# Altium schematic sheet 03_MCU部分.SchDoc
size A4; DocumentNumber: 3; SheetNumber: 3; SheetTotal: 4
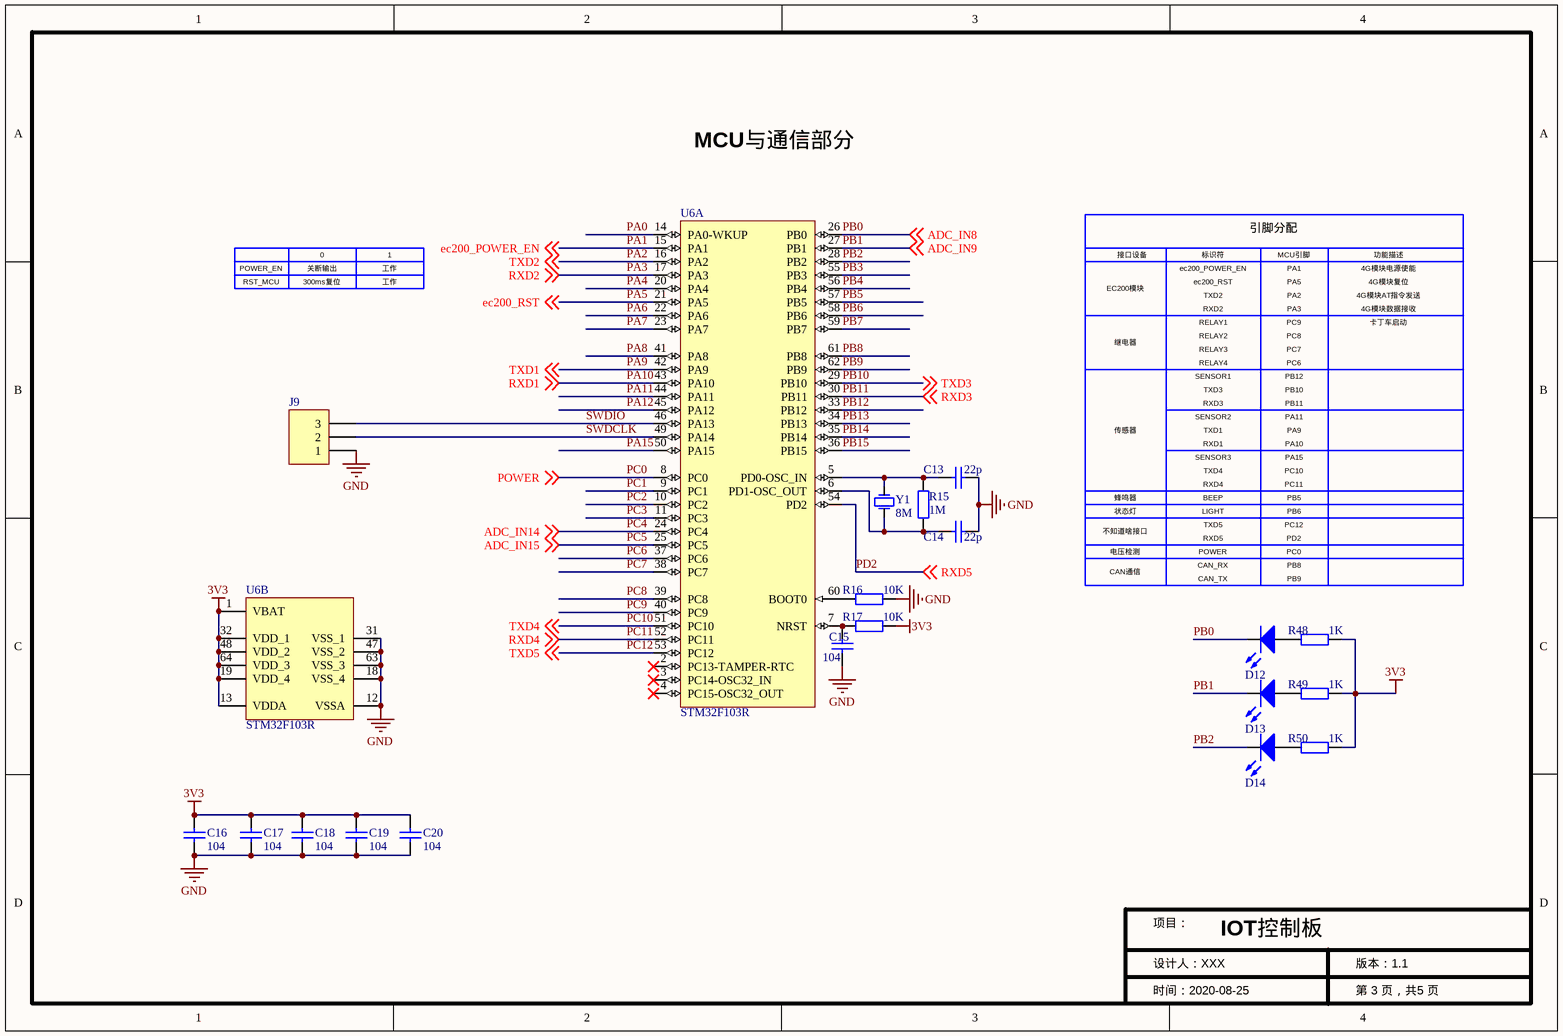
[diagram p0: 03_MCU部分.SchDoc]

## Parts
C13  value 22p  [CAP-0603]  (hidden comment: Cap)
C14  value 22p  [CAP-0603]  (hidden comment: Cap)
C15  value 104  [CAP-0603]  (hidden comment: Cap)
C16  value 104  [CAP-0603]  (hidden comment: Cap)
C17  value 104  [CAP-0603]  (hidden comment: Cap)
C18  value 104  [CAP-0603]  (hidden comment: Cap)
C19  value 104  [CAP-0603]  (hidden comment: Cap)
C20  value 104  [CAP-0603]  (hidden comment: Cap)
D12  LED  [LED_0805]  (value not drawn)
D13  LED  [LED_0805]  (value not drawn)
D14  LED  [LED_0805]  (value not drawn)
J9  Header3  [Header_3X1_2.54_排针]  (value not drawn)
R15  value 1M  [0603]  (hidden comment: Res)
R16  value 10K  [0603]  (hidden comment: Res)
R17  value 10K  [0603]  (hidden comment: Res)
R48  value 1K  [0603]  (hidden comment: Res)
R49  value 1K  [0603]  (hidden comment: Res)
R50  value 1K  [0603]  (hidden comment: Res)
U6  STM32F103R  [LQFP64]  (parts A,B of 2)
Y1  value 8M  [X-SM49]  (hidden comment: XTAL)

## Nets
3V3: C16.2 C17.2 C18.2 C19.2 C20.2 R17.1 R48.1 R49.1 R50.1 U6.1(VBAT) U6.13(VDDA) U6.19(VDD_4) U6.32(VDD_1) U6.48(VDD_2) U6.64(VDD_3)
GND: C13.1 C14.1 C15.1 C16.1 C17.1 C18.1 C19.1 C20.1 J9.1 R16.1 U6.12(VSSA) U6.18(VSS_4) U6.31(VSS_1) U6.47(VSS_2) U6.63(VSS_3)
PA0: U6.14(PA0-WKUP)
PA1: U6.15(PA1) ; off-sheet ec200_POWER_EN  [also labelled ec200_POWER_EN]
PA2: U6.16(PA2) ; off-sheet TXD2  [also labelled TXD2]
PA3: U6.17(PA3) ; off-sheet RXD2  [also labelled RXD2]
PA4: U6.20(PA4)
PA5: U6.21(PA5) ; off-sheet ec200_RST  [also labelled ec200_RST]
PA6: U6.22(PA6)
PA7: U6.23(PA7)
PA8: U6.41(PA8)
PA9: U6.42(PA9) ; off-sheet TXD1  [also labelled TXD1]
PA10: U6.43(PA10) ; off-sheet RXD1  [also labelled RXD1]
PA11: U6.44(PA11)
PA12: U6.45(PA12)
PA15: U6.50(PA15)
PB0: D12.2(K) U6.26(PB0) ; off-sheet ADC_IN8  [also labelled ADC_IN8]
PB1: D13.2(K) U6.27(PB1) ; off-sheet ADC_IN9  [also labelled ADC_IN9]
PB2: D14.2(K) U6.28(PB2)
PB3: U6.55(PB3)
PB4: U6.56(PB4)
PB5: U6.57(PB5)
PB6: U6.58(PB6)
PB7: U6.59(PB7)
PB8: U6.61(PB8)
PB9: U6.62(PB9)
PB10: U6.29(PB10) ; off-sheet TXD3  [also labelled TXD3]
PB11: U6.30(PB11) ; off-sheet RXD3  [also labelled RXD3]
PB12: U6.33(PB12)
PB13: U6.34(PB13)
PB14: U6.35(PB14)
PB15: U6.36(PB15)
PC0: U6.8(PC0) ; off-sheet POWER  [also labelled POWER]
PC1: U6.9(PC1)
PC2: U6.10(PC2)
PC3: U6.11(PC3)
PC4: U6.24(PC4) ; off-sheet ADC_IN14  [also labelled ADC_IN14]
PC5: U6.25(PC5) ; off-sheet ADC_IN15  [also labelled ADC_IN15]
PC6: U6.37(PC6)
PC7: U6.38(PC7)
PC8: U6.39(PC8)
PC9: U6.40(PC9)
PC10: U6.51(PC10) ; off-sheet TXD4  [also labelled TXD4]
PC11: U6.52(PC11) ; off-sheet RXD4  [also labelled RXD4]
PC12: U6.53(PC12) ; off-sheet TXD5  [also labelled TXD5]
PD2: U6.54(PD2) ; off-sheet RXD5  [also labelled RXD5]
SWDCLK: J9.2 U6.49(PA14)
SWDIO: J9.3 U6.46(PA13)
NetC13_2: C13.2 R15.2 U6.5(PD0-OSC_IN) Y1.2
NetC14_2: C14.2 R15.1 U6.6(PD1-OSC_OUT) Y1.1
NetC15_2: C15.2 R17.2 U6.7(NRST)
NetD12_1: D12.1(A) R48.2
NetD13_1: D13.1(A) R49.2
NetD14_1: D14.1(A) R50.2
NetR16_2: R16.2 U6.60(BOOT0)

Not connected (* = marked no-connect by the designer): U6 2(PC13-TAMPER-RTC)* 3(PC14-OSC32_IN)* 4(PC15-OSC32_OUT)*

## Notes on the sheet
- MCU与通信部分
- 0
- 1
- 接口设备
- 标识符
- 引脚分配
- MCU引脚
- 功能描述
- POWER_EN
- RST_MCU
- 关断输出
- 300ms复位
- 工作
- EC200模块
- ec200_POWER_EN
- ec200_RST
- TXD2
- RXD2
- PA1
- PA5
- PA2
- PA3
- 4G模块电源使能
- 4G模块复位
- 4G模块AT指令发送
- 4G模块数据接收
- 继电器
- RELAY1
- RELAY2
- RELAY3
- RELAY4
- SENSOR1
- TXD3
- PB10
- PB12
- PC6
- PC7
- PC8
- PC9
- 卡丁车启动
- 传感器
- RXD3
- SENSOR2
- TXD1
- RXD1
- PB11
- PA9
- PA10
- PA11
- 蜂鸣器
- 状态灯
- SENSOR3
- BEEP
- LIGHT
- TXD5
- TXD4
- RXD4
- PC12
- PC10
- PC11
- PA15
- PB6
- PB5
- 不知道啥接口
- 电压检测
- CAN通信
- RXD5
- POWER
- CAN_RX
- CAN_TX
- PD2
- PC0
- PB8
- PB9
- 项目：
- IOT控制板
- 设计人：XXX
- 时间：2020-08-25
- 第 3 页，共5 页
- 版本：1.1

## Library data of the parts
C13-C20 = Cap: 无极性电容; Published: 8-Jun-2000; LatestRevisionDate: 17-Jul-2002; LatestRevisionNote: Re-released for DXP Platform.; PackageReference: RAD-0.3; Publisher: Altium Limited
D12-D14 = LED: 发光二极管; Published: 8-Jun-2000; LatestRevisionDate: 08-Jul-2005; LatestRevisionNote: Mech Layer 1 removed.; PackageReference: LED-0; Publisher: Altium Limited
J9 = Header3: 接插件
R15-R17 R48-R50 = Res: 贴片电阻; Published: 8-Jun-2000; LatestRevisionDate: 17-Jul-2002; LatestRevisionNote: Re-released for DXP Platform.; PackageReference: AXIAL-0.4; Publisher: Altium Limited
U6 = STM32F103R: STM32单片机64引脚; PartNumber: STM32F103RGT6; A/D Converter: 3x12-bit (16 Channel); Core: ARM Cortex-M3; D/A Converter: 2x12-bit (2 Channel); FLASH Size (Prog) (kB): 1024; I/Os (High Current): 51; Internal RAM Size (kB): 96; Operating Frequency(F) (Processor speed) (MHz): 72; Packing: Tray; Supply Voltage(Vcc) min (V): 2; DatasheetVersion: Rev. 3; PackageVersion: Rev. 4, 06/2013; PackageReference: LQFP64; PackageDescription: 64-Pin Low Profile Quad Flat Package, 10 x 10 mm Body, 0.5 mm Pitch; Supplier 1: Digi-Key; Supplier Part Number 1: 497-11118-ND; Supplier 2: Farnell; Supplier Part Number 2: 2215220; Supplier 3: Newark; Supplier Part Number 3: 21T4016; Supplier 4: Mouser; Supplier Part Number 4: 511-STM32F103RGT6; Mounting Technology: Surface Mount; ComponentLink1Description: Manufacturer URL; ComponentLink1URL: http://www.st.com/web/en/home.html; ComponentLink2Description: Datasheet; ComponentLink2URL: http://www.st.com/st-web-ui/static/active/en/resource/technical/document/datasheet/CD00253742.pdf; ComponentLink3Description: Package Specification; ComponentLink3URL: http://www.st.com/st-web-ui/static/active/en/resource/technical/document/datasheet/DM00037051.pdf
Y1 = XTAL: 晶振; Published: 8-Jun-2000; LatestRevisionDate: 17-Jul-2002; LatestRevisionNote: Re-released for DXP Platform.; PackageReference: R38; Publisher: Altium Limited